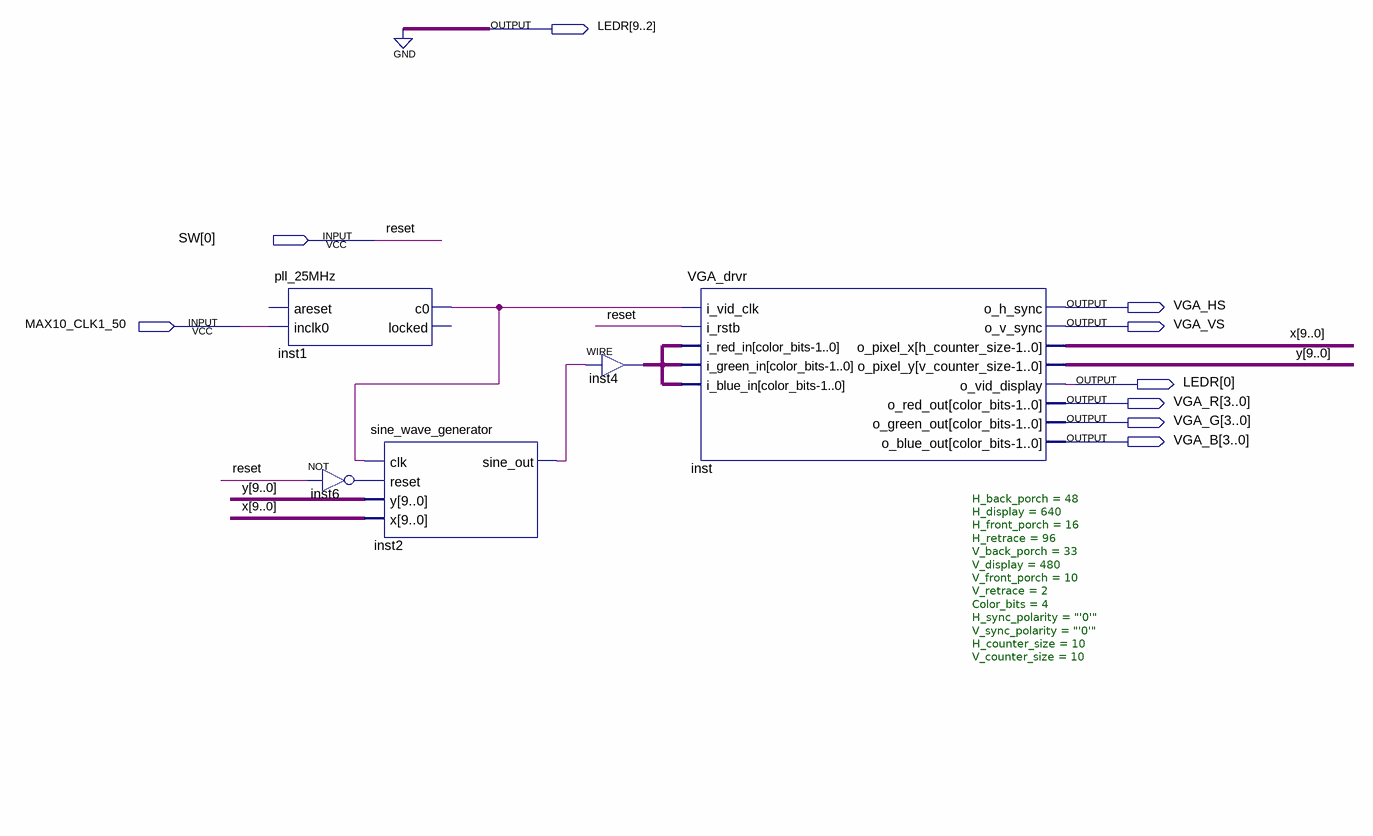
[diagram p0: schematic sheet]
// Quartus schematic vga1.bdf as structural Verilog: 5 symbols, 9 pins
module vga1 (
  input  [0:0] SW,
  input  MAX10_CLK1_50,
  output [9:0] LEDR,
  output VGA_HS,
  output VGA_VS,
  output [3:0] VGA_R,
  output [3:0] VGA_G,
  output [3:0] VGA_B
);

  wire inst1_c0, inst2_sine_out, inst6_out;
  wire [3:0] inst4_out;
  wire [9:0] x, y;

  pll_25MHz inst1 (.inclk0(MAX10_CLK1_50), .c0(inst1_c0));  // open: areset, locked
  not inst6 (inst6_out, SW[0]);
  sine_wave_generator inst2 (.clk(inst1_c0), .reset(inst6_out), .y(y), .x(x), .sine_out(inst2_sine_out));
  assign inst4_out = {4{inst2_sine_out}};  // WIRE inst4
  VGA_drvr #(.H_back_porch(48), .H_display(640), .H_front_porch(16), .H_retrace(96), .V_back_porch(33), .V_display(480), .V_front_porch(10), .V_retrace(2), .Color_bits(4), .H_sync_polarity("'0'"), .V_sync_polarity("'0'"), .H_counter_size(10), .V_counter_size(10)) inst (
    .i_vid_clk(inst1_c0), .i_rstb(SW[0]), .i_red_in(inst4_out), .i_green_in(inst4_out),
    .i_blue_in(inst4_out), .o_h_sync(VGA_HS), .o_v_sync(VGA_VS), .o_pixel_x(x), .o_pixel_y(y),
    .o_vid_display(LEDR[0]), .o_red_out(VGA_R), .o_green_out(VGA_G), .o_blue_out(VGA_B));

  assign LEDR[9:2] = {8{1'b0}};

  // Other names for the same wires on the sheet: reset = SW[0]
endmodule
